# EAGLE design arduino (EAGLE 8.1.1)
AUTHOR: Pat Pannuto; REV: A; TITLE: Seinduino

## Sheet 1 of 2
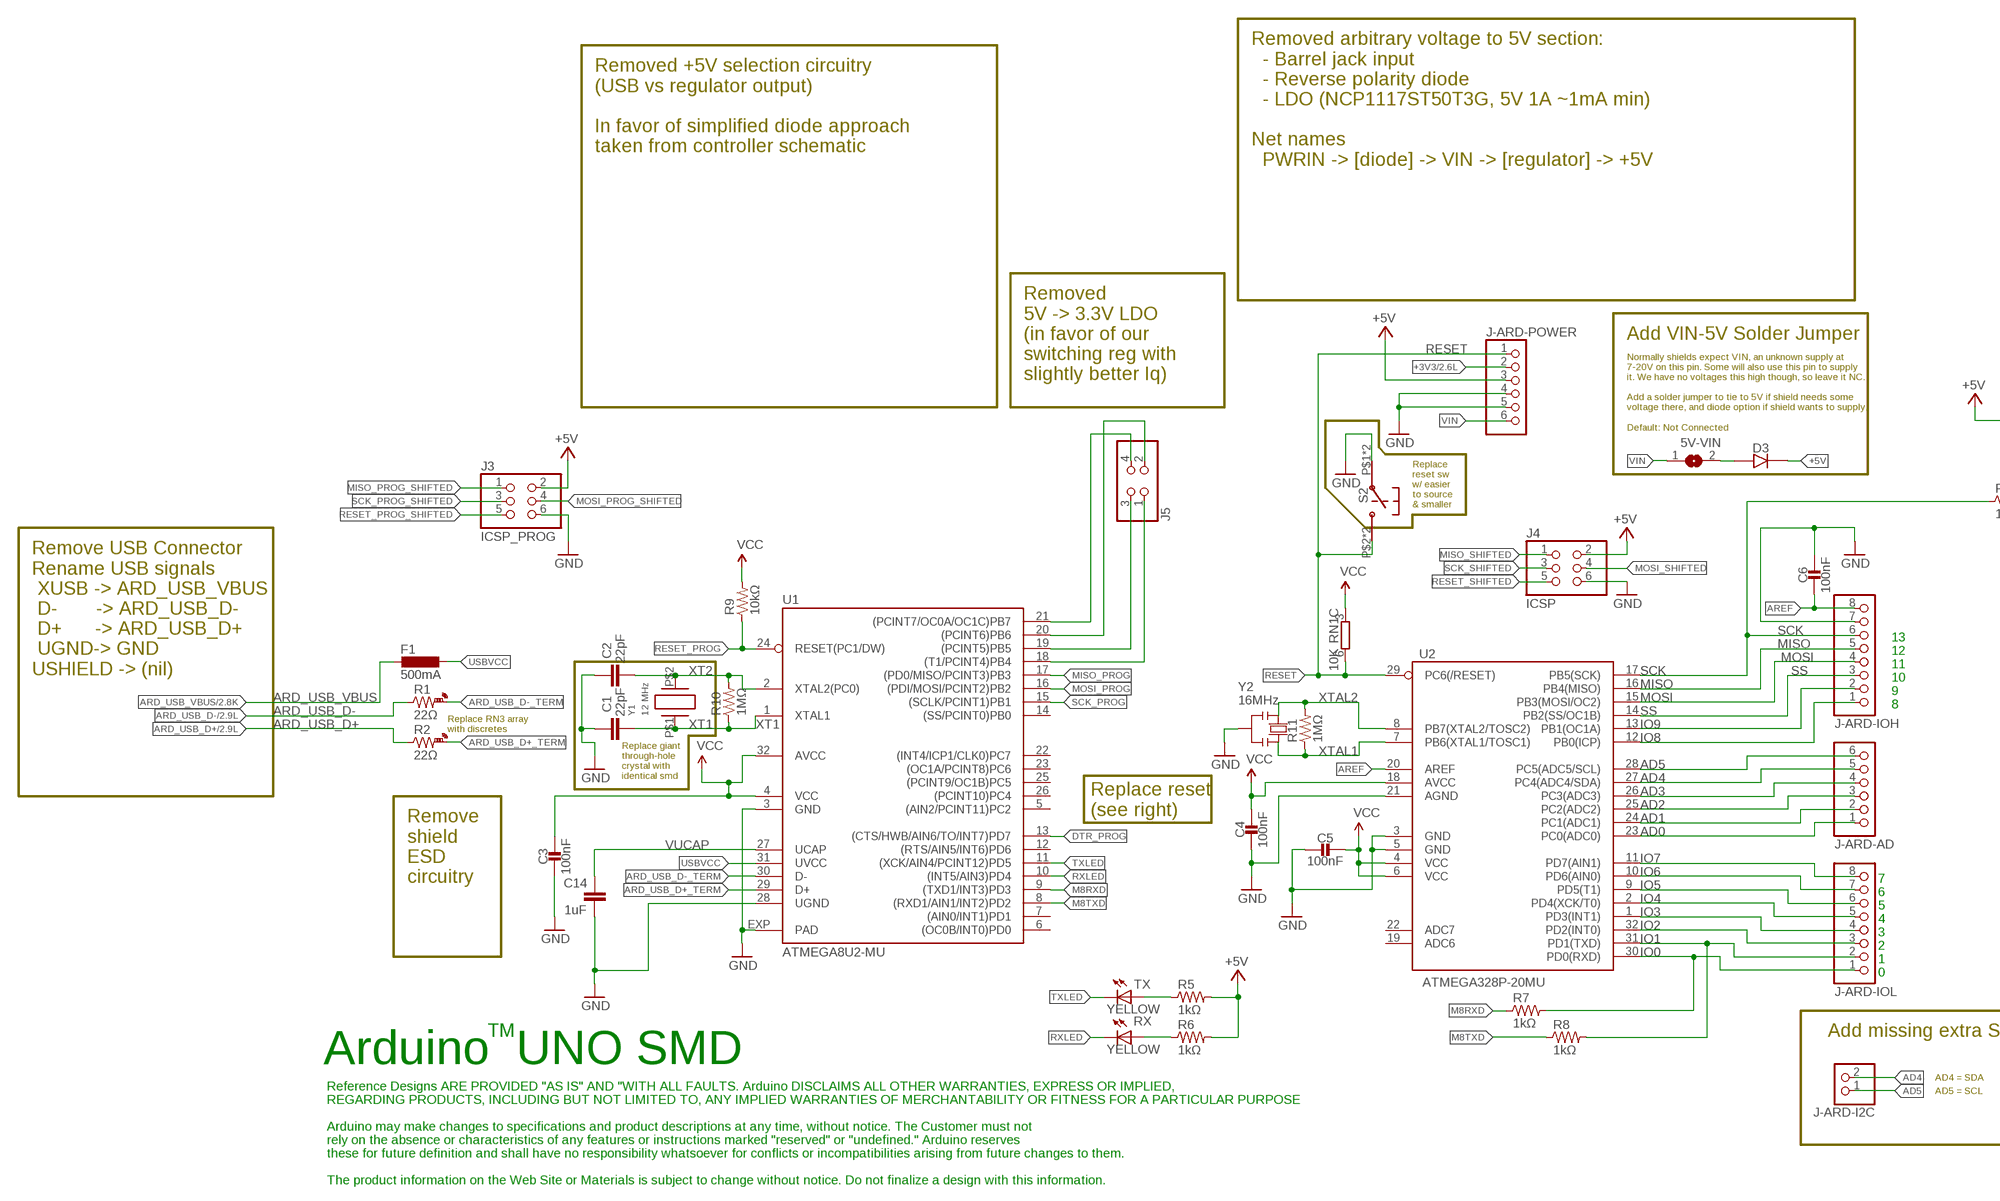
[diagram p0: schematic, sheet 1, part 1 of 2]
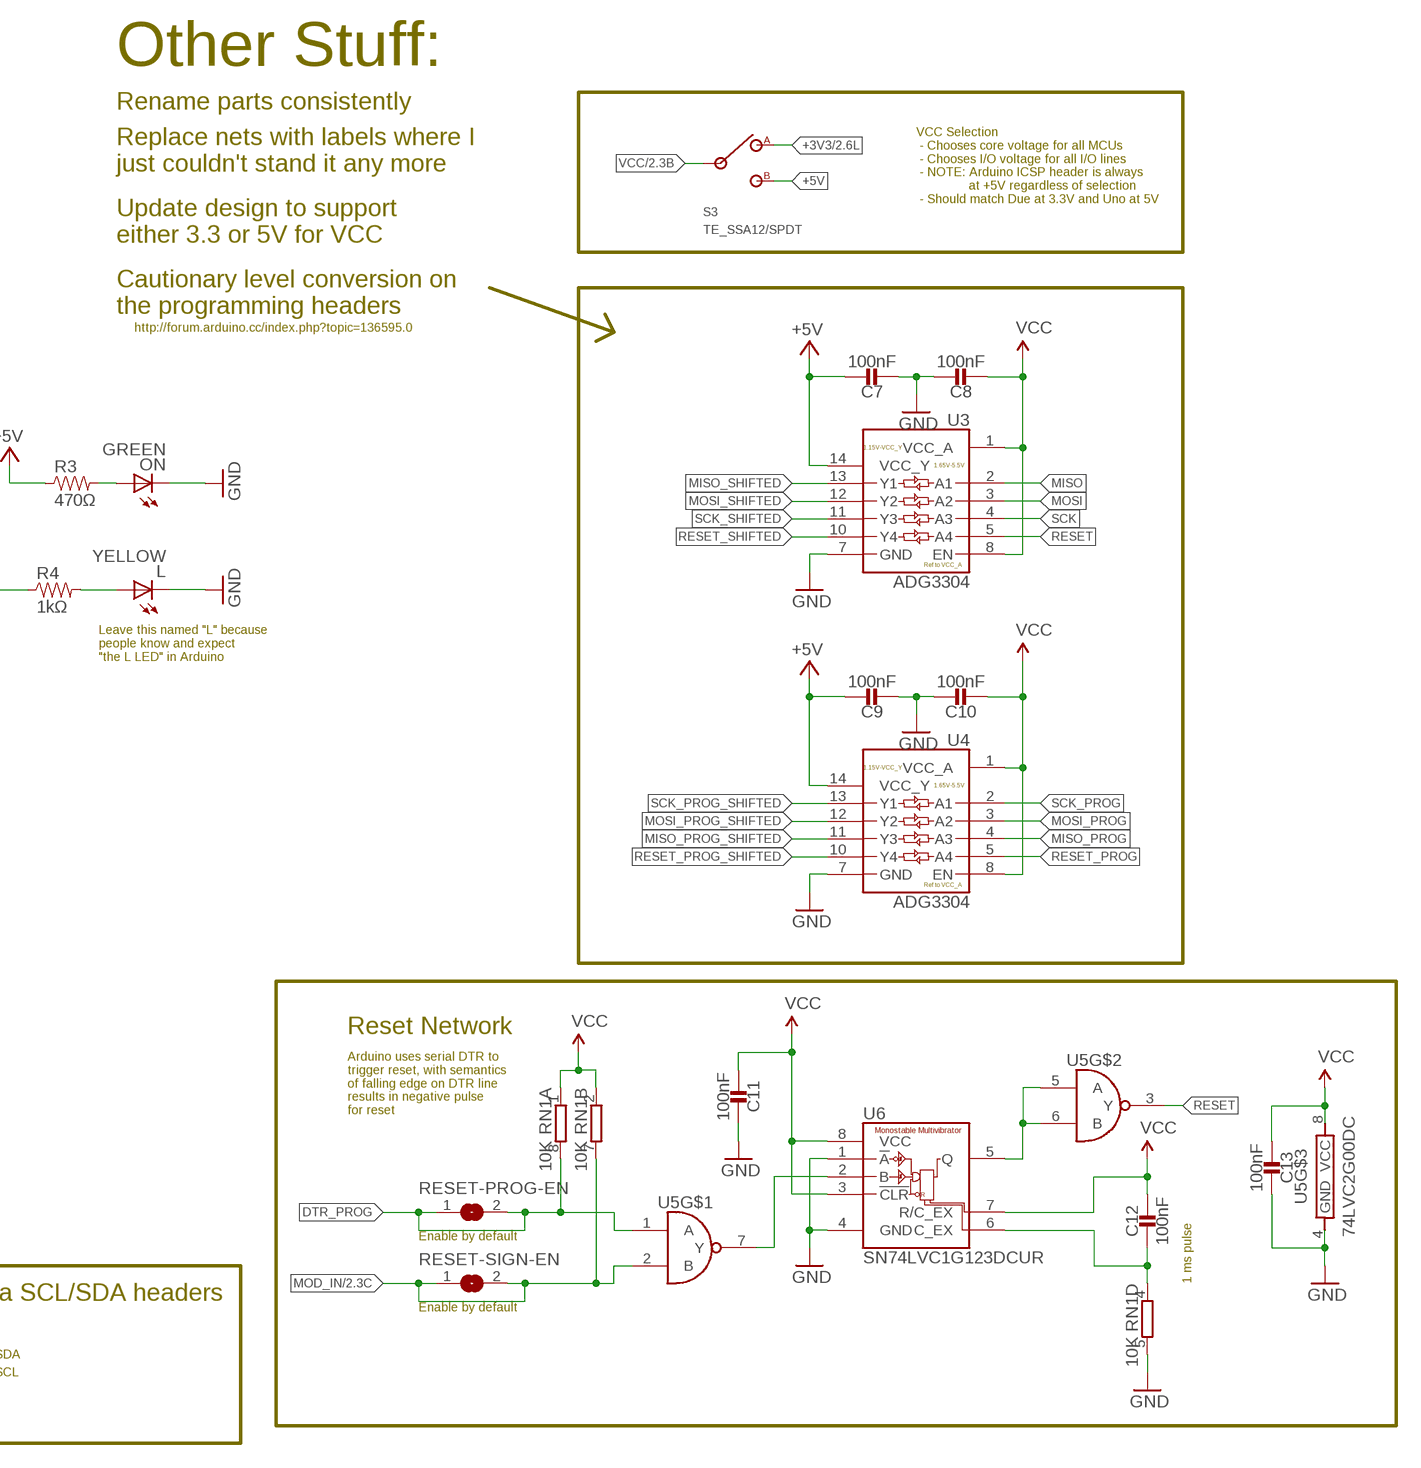
[diagram p1: schematic, sheet 1, part 2 of 2]

### Parts
5V-VIN  SJ  [SJ]
C1  22pF  C-EU0603-RND  [C0603-ROUND]
C2  22pF  C-EU0603-RND  [C0603-ROUND]
C3  100nF  CAPACITOR0603_CAP  [0603_CAP]
C4  100nF  CAPACITOR0603_CAP  [0603_CAP]
C5  100nF  CAPACITOR0603_CAP  [0603_CAP]
C6  100nF  CAPACITOR0603_CAP  [0603_CAP]
C7  100nF  CAPACITOR0603_CAP  [0603_CAP]
C8  100nF  CAPACITOR0603_CAP  [0603_CAP]
C9  100nF  CAPACITOR0603_CAP  [0603_CAP]
C10  100nF  CAPACITOR0603_CAP  [0603_CAP]
C11  100nF  CAPACITOR0603_CAP  [0603_CAP]
C12  100nF  CAPACITOR0603_CAP  [0603_CAP]
C13  100nF  CAPACITOR0603_CAP  [0603_CAP]
C14  1uF  C-EU0603-RND  [C0603-ROUND]
D3  DIODE  [0402_DIODE]
F1  500mA  L-EUL1812  [L1812]
J3  ICSP_PROG  PINHD-2X3  [2X03]
J4  ICSP  PINHD-2X3  [2X03]
J5  PINHD-2X2  [2X02]
J-ARD-AD  PINHD-1X6  [1X06]
J-ARD-I2C  PINHD-1X2  [1X02]
J-ARD-IOH  PINHD-1X8  [1X08]
J-ARD-IOL  PINHD-1X8  [1X08]
J-ARD-POWER  PINHD-1X6  [1X06]
L  YELLOW  LEDCHIP-LED0805  [CHIP-LED0805]
ON  GREEN  LEDCHIP-LED0805  [CHIP-LED0805]
R1  22Ω  RESISTOR-HIGH_SPEED0402  [0402_RES-HIGH_SPEED]
R2  22Ω  RESISTOR-HIGH_SPEED0402  [0402_RES-HIGH_SPEED]
R3  470Ω  RESISTOR0603_RES  [0603-RES]
R4  1kΩ  RESISTOR0603_RES  [0603-RES]
R5  1kΩ  RESISTOR0603_RES  [0603-RES]
R6  1kΩ  RESISTOR0603_RES  [0603-RES]
R7  1kΩ  RESISTOR0603_RES  [0603-RES]
R8  1kΩ  RESISTOR0603_RES  [0603-RES]
R9  10kΩ  RESISTOR0603_RES  [0603-RES]
R10  1MΩ  RESISTOR0603_RES  [0603-RES]
R11  1MΩ  RESISTOR0603_RES  [0603-RES]
RESET-PROG-EN  SJ  [SJ]
RESET-SIGN-EN  SJ  [SJ]
RN1  10K  4R-NCAY16  [CAY16]
RX  YELLOW  LEDCHIP-LED0805  [CHIP-LED0805]
S2  EVQP2  [EVQP2]
S3  TE_SSA12/SPDT  [TE_SSA12/SPDT]
TX  YELLOW  LEDCHIP-LED0805  [CHIP-LED0805]
U1  ATMEGA8U2-MU  [QFN32]
U2  ATMEGA328P-20MU  MEGA8-MI  [MLF32]
U3  ADG3304  [TSSOP-14/5MM]
U4  ADG3304  [TSSOP-14/5MM]
U5  74LVC2G00DC  [VSSOP-8]
U6  SN74LVC1G123DCUR  [VFSOP-8]
Y1  12 MHz  ABM3  [ABM3]
Y2  16MHz  RESONATORMU  [RESONATOR]

### Nets
+3V3: J-ARD-POWER.2 S3.1(A) ; also sheet 2
+5V [usbvcc]: C7.1 C9.1 D3.CATHODE J3.2 J4.2 J-ARD-POWER.3 R3.1 R5.2 R6.2 S3.2(B) U3.14(VCC_Y) U4.14(VCC_Y) ; also sheet 2
AD0: J-ARD-AD.1 U2.23(PC0(ADC0))
AD1: J-ARD-AD.2 U2.24(PC1(ADC1))
AD2: J-ARD-AD.3 U2.25(PC2(ADC2))
AD3: J-ARD-AD.4 U2.26(PC3(ADC3))
AD4: J-ARD-AD.5 J-ARD-I2C.2 U2.27(PC4(ADC4/SDA))
AD5: J-ARD-AD.6 J-ARD-I2C.1 U2.28(PC5(ADC5/SCL))
ARD_USB_D+: R2.2 ; also sheet 2
ARD_USB_D+_TERM: R2.1 U1.29(D+)
ARD_USB_D-: R1.2 ; also sheet 2
ARD_USB_D-_TERM: R1.1 U1.30(D-)
ARD_USB_VBUS [usbvcc]: F1.2 ; also sheet 2
AREF [aref]: C6.2 J-ARD-IOH.8 U2.20(AREF)
DTR_PROG: RESET-PROG-EN.1 RESET-PROG-EN.2 RN1.8 U1.13((CTS/HWB/AIN6/TO/INT7)PD7) U5.1(A)
GND [gnd]: C1.2 C2.2 C3.2 C4.2 C5.2 C6.1 C7.2 C8.1 C9.2 C10.1 C11.1 C13.1 C14.2 J3.6 J4.6 J-ARD-IOH.7 J-ARD-POWER.4 J-ARD-POWER.5 L.C ON.C RN1.5 S2.P$1 S2.P$3 U1.3(GND) U1.28(UGND) U1.EXP(PAD) U2.3(GND) U2.5(GND) U2.21(AGND) U3.7(GND) U4.7(GND) U5.4(GND) U6.1(!A) U6.4(GND) Y2.2 ; also sheet 2
IO0: J-ARD-IOL.1 R7.2 U2.30(PD0(RXD))
IO1: J-ARD-IOL.2 R8.2 U2.31(PD1(TXD))
IO2: J-ARD-IOL.3 U2.32(PD2(INT0))
IO3: J-ARD-IOL.4 U2.1(PD3(INT1))
IO4: J-ARD-IOL.5 U2.2(PD4(XCK/T0))
IO5: J-ARD-IOL.6 U2.9(PD5(T1))
IO6: J-ARD-IOL.7 U2.10(PD6(AIN0))
IO7: J-ARD-IOL.8 U2.11(PD7(AIN1))
IO8: J-ARD-IOH.1 U2.12(PB0(ICP))
IO9: J-ARD-IOH.2 U2.13(PB1(OC1A))
M8RXD: R7.1 U1.9((TXD1/INT3)PD3)
M8TXD: R8.1 U1.8((RXD1/AIN1/INT2)PD2)
MISO: J-ARD-IOH.5 U2.16(PB4(MISO)) U3.2(A1)
MISO_PROG: U1.17((PD0/MISO/PCINT3)PB3) U4.4(A3)
MISO_PROG_SHIFTED: J3.1 U4.11(Y3)
MISO_SHIFTED: J4.1 U3.13(Y1)
MOD_IN: RESET-SIGN-EN.1 RESET-SIGN-EN.2 RN1.7 U5.2(B) ; also sheet 2
MOSI: J-ARD-IOH.4 U2.15(PB3(MOSI/OC2)) U3.3(A2)
MOSI_PROG: U1.16((PDI/MOSI/PCINT2)PB2) U4.3(A2)
MOSI_PROG_SHIFTED: J3.4 U4.12(Y2)
MOSI_SHIFTED: J4.4 U3.12(Y2)
N$1: L.A R4.2
N$2: J5.1 U1.18((T1/PCINT4)PB4)
N$3: ON.A R3.2
N$4: J5.3 U1.19((PCINT5)PB5)
N$5: J5.2 U1.20((PCINT6)PB6)
N$6: J5.4 U1.21((PCINT7/OC0A/OC1C)PB7)
N$7: C12.2 RN1.4 U6.6(C_EX)
N$9: 5V-VIN.2 D3.ANODE
N$10: U5.7(Y) U6.2(B)
N$13: U5.5(A) U5.6(B) U6.5(Q)
N$35: R6.1 RX.A
N$36: R5.1 TX.A
RESET: J-ARD-POWER.1 RN1.6 S2.P$2 S2.P$4 U2.29(PC6(/RESET)) U3.5(A4) U5.3(Y)
RESET_PROG: R9.1 U1.24(RESET(PC1/DW)) U4.5(A4)
RESET_PROG_SHIFTED: J3.5 U4.10(Y4)
RESET_SHIFTED: J4.5 U3.10(Y4)
RXLED: RX.C U1.10((INT5/AIN3)PD4)
SCK: J-ARD-IOH.6 R4.1 U2.17(PB5(SCK)) U3.4(A3)
SCK_PROG: U1.15((SCLK/PCINT1)PB1) U4.2(A1)
SCK_PROG_SHIFTED: J3.3 U4.13(Y1)
SCK_SHIFTED: J4.3 U3.11(Y3)
SS: J-ARD-IOH.3 U2.14(PB2(SS/OC1B))
TXLED: TX.C U1.11((XCK/AIN4/PCINT12)PD5)
USBVCC [usbvcc]: F1.1 U1.31(UVCC)
VCC: C3.1 C4.1 C5.1 C8.2 C10.2 C11.2 C12.1 C13.2 R9.2 RN1.1 RN1.2 RN1.3 S3.IN U1.4(VCC) U1.32(AVCC) U2.4(VCC) U2.6(VCC) U2.18(AVCC) U3.1(VCC_A) U3.8(EN) U4.1(VCC_A) U4.8(EN) U5.8(VCC) U6.3(!CLR) U6.7(R/C_EX) U6.8(VCC) ; also sheet 2
VIN [power]: 5V-VIN.1 J-ARD-POWER.6
VUCAP: C14.1 U1.27(UCAP)
XT1: C1.1 R10.1 U1.1(XTAL1) Y1.P$1
XT2: C2.1 R10.2 U1.2(XTAL2(PC0)) Y1.P$2
XTAL1: R11.1 U2.7(PB6(XTAL1/TOSC1)) Y2.3
XTAL2: R11.2 U2.8(PB7(XTAL2/TOSC2)) Y2.1
Unconnected: U1.5((AIN2/PCINT11)PC2) U1.6((OC0B/INT0)PD0) U1.7((AIN0/INT1)PD1) U1.12((RTS/AIN5/INT6)PD6) U1.14((SS/PCINT0)PB0) U1.22((INT4/ICP1/CLK0)PC7) U1.23((OC1A/PCINT8)PC6) U1.25((PCINT9/OC1B)PC5) U1.26((PCINT10)PC4) U2.19(ADC6) U2.22(ADC7)

### Notes on the sheet
- This board starts from the official Arduino UNO SMD (aka UNO RevG-MU), available here:
  https://www.arduino.cc/en/uploads/Main/arduino-uno-smd-reference-design.zip
  
  Modifications to the Ardunio layout are noted on the guide layer of this sheet
- Removed arbitrary voltage to 5V section:
    - Barrel jack input
    - Reverse polarity diode
    - LDO (NCP1117ST50T3G, 5V 1A ~1mA min)
  
  Net names
    PWRIN -> [diode] -> VIN -> [regulator] -> +5V
- Removed +5V selection circuitry
  (USB vs regulator output)
  
  In favor of simplified diode approach
  taken from controller schematic
- Other Stuff:
- Rename parts consistently
- Replace nets with labels where I
  just couldn't stand it any more
- VCC Selection
   - Chooses core voltage for all MCUs
   - Chooses I/O voltage for all I/O lines
   - NOTE: Arduino ICSP header is always
                 at +5V regardless of selection
   - Should match Due at 3.3V and Uno at 5V
- Update design to support
  either 3.3 or 5V for VCC
- Cautionary level conversion on
  the programming headers
- Removed
  5V -> 3.3V LDO
  (in favor of our
  switching reg with
  slightly better Iq)
- http://forum.arduino.cc/index.php?topic=136595.0
- Add VIN-5V Solder Jumper
- Normally shields expect VIN, an unknown supply at
  7-20V on this pin. Some will also use this pin to supply
  it. We have no voltages this high though, so leave it NC.
  
  Add a solder jumper to tie to 5V if shield needs some
  voltage there, and diode option if shield wants to supply.
  
  Default: Not Connected
- Replace
  reset sw
  w/ easier
  to source
  & smaller
- Leave this named "L" because
  people know and expect
  "the L LED" in Arduino
- Remove USB Connector
  Rename USB signals
   XUSB -> ARD_USB_VBUS
   D-       -> ARD_USB_D-
   D+      -> ARD_USB_D+
   UGND-> GND
  USHIELD -> (nil)
- 13
- 12
- 11
- 10
- 9
- 8
- Replace RN3 array
  with discretes
- Replace giant
  through-hole
  crystal with
  identical smd
- Replace reset
  (see right)
- Remove
  shield
  ESD
  circuitry
- Reset Network
- Arduino uses serial DTR to
  trigger reset, with semantics
  of falling edge on DTR line
  results in negative pulse
  for reset
- 7
- 6
- 5
- 4
- 3
- 2
- 1
- 0
- Enable by default
- 1 ms pulse
- TM | Add missing extra SCL/SDA headers | Enable by default
- Arduino  UNO SMD
- AD4 = SDA
- Reference Designs ARE PROVIDED "AS IS" AND "WITH ALL FAULTS. Arduino DISCLAIMS ALL OTHER WARRANTIES, EXPRESS OR IMPLIED, | AD5 = SCL
- REGARDING PRODUCTS, INCLUDING BUT NOT LIMITED TO, ANY IMPLIED WARRANTIES OF MERCHANTABILITY OR FITNESS FOR A PARTICULAR PURPOSE
- Arduino may make changes to specifications and product descriptions at any time, without notice. The Customer must not
- rely on the absence or characteristics of any features or instructions marked "reserved" or "undefined." Arduino reserves
- these for future definition and shall have no responsibility whatsoever for conflicts or incompatibilities arising from future changes to them.
- The product information on the Web Site or Materials is subject to change without notice. Do not finalize a design with this information.

## Sheet 2 of 2
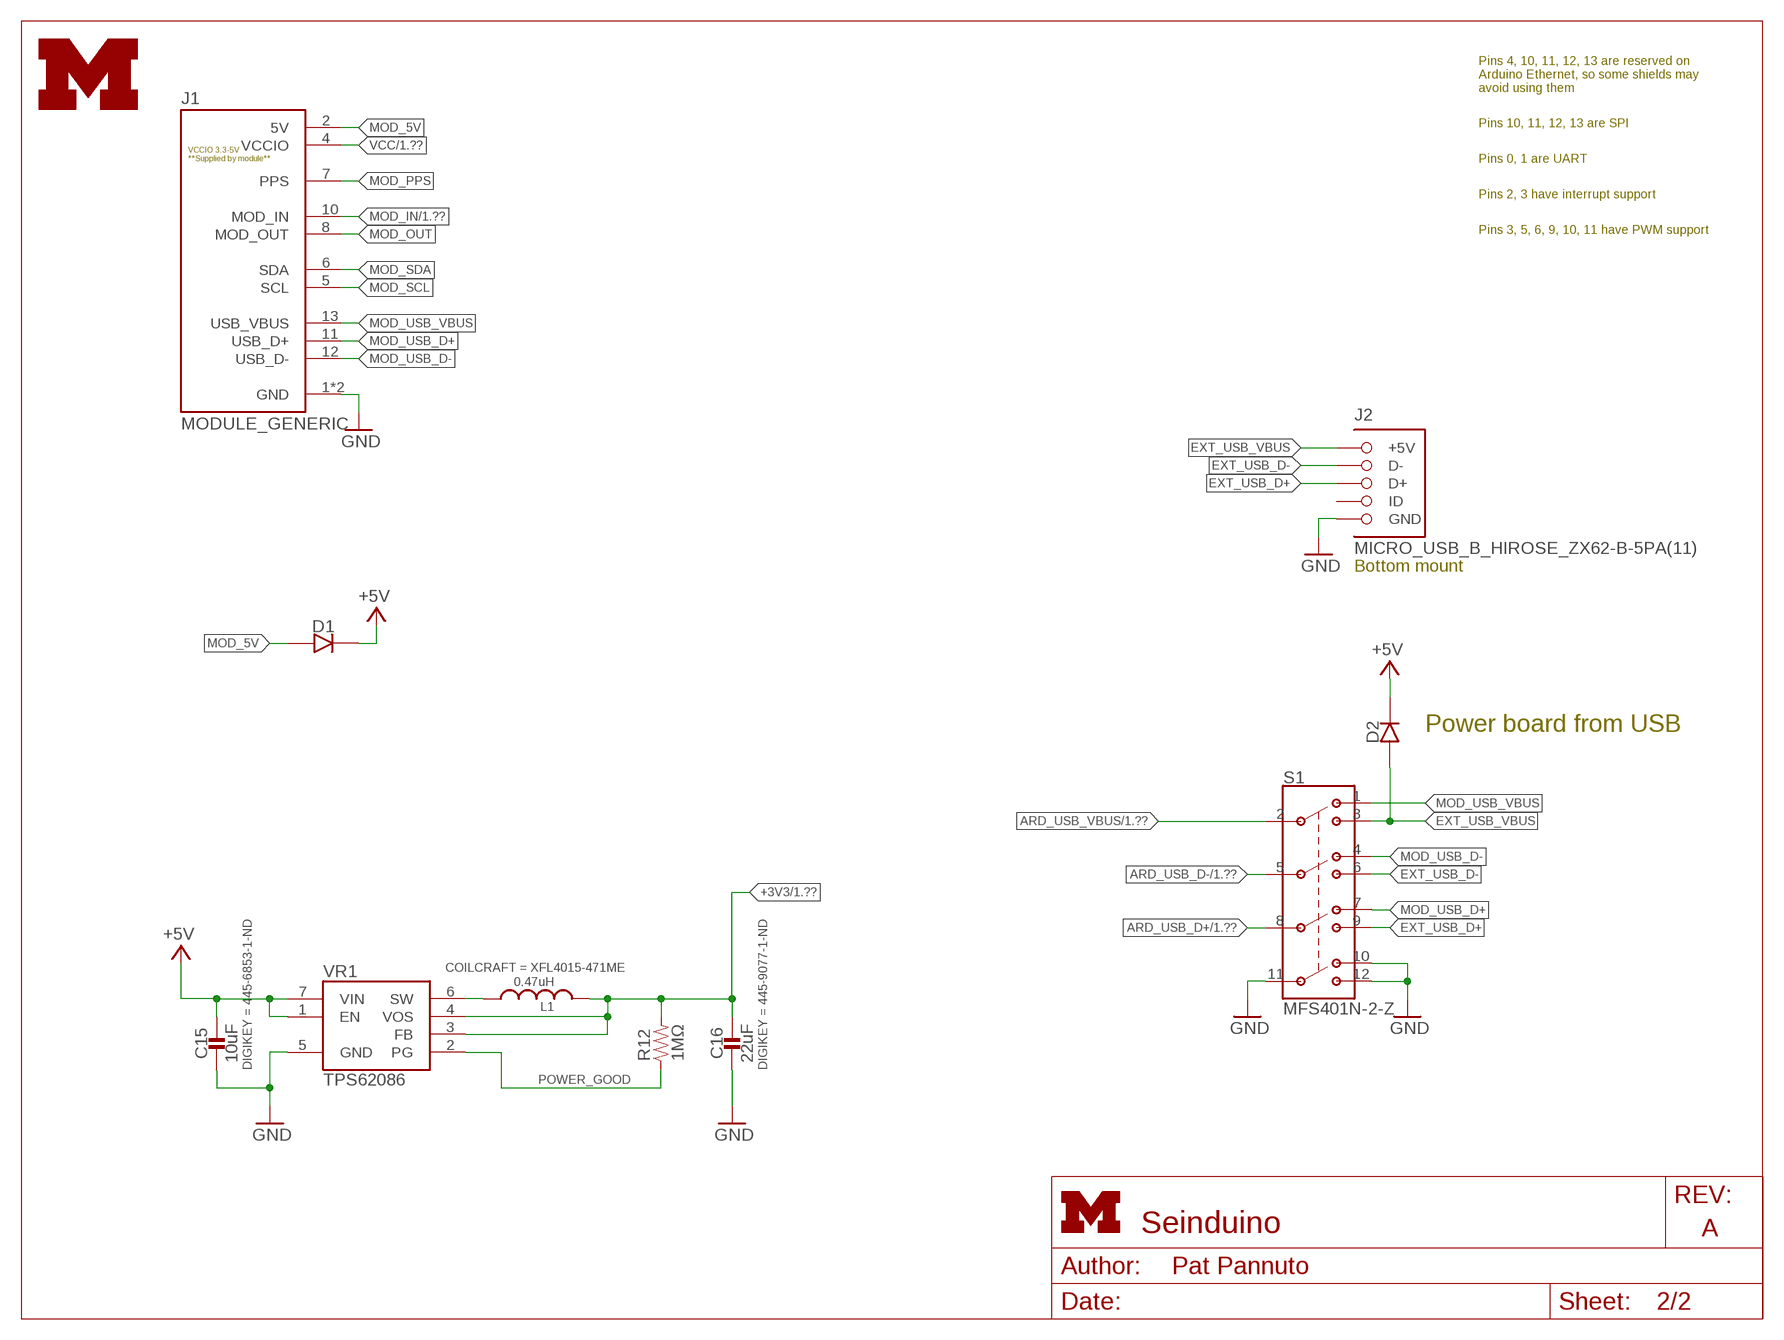
[diagram p2: schematic, sheet 2]
FRAME1 (LETTER_L_UMICH): HEIGHT: 8.5in; WIDTH: 11in

### Parts
C15  10uF  CAPACITOR0603_CAP  [0603_CAP]
C16  22uF  CAPACITOR0603_CAP  [0603_CAP]
D1  DIODE  [0402_DIODE]
D2  DIODE  [0402_DIODE]
J1  MODULE_GENERIC  [MODULE_GENERIC]
J2  MICRO_USB_B_HIROSE_ZX62-B-5PA(11)  [USB_MICRO_B-HIROSE-ZX62-B-5PA(11)]
L1  0.47uH  INDUCTORXFL4015  [XFL4015]
LOGO1  UMICH_SOLID_MEDIUM  [UMICH_SOLID_200MIL]
R12  1MΩ  RESISTOR0603_RES  [0603-RES]
S1  MFS401N-2-Z  [MFS401N-2-Z]
VR1  TPS62086  [RLT0007A]

### Nets
+3V3: C16.1 L1.2 R12.2 VR1.3(FB) VR1.4(VOS) ; also sheet 1
+5V [usbvcc]: C15.1 D1.CATHODE D2.CATHODE VR1.1(EN) VR1.7(VIN) ; also sheet 1
ARD_USB_D+: S1.8(3P) ; also sheet 1
ARD_USB_D-: S1.5(2P) ; also sheet 1
ARD_USB_VBUS [usbvcc]: S1.2(1P) ; also sheet 1
EXT_USB_D+: J2.3(D+) S1.9(3TB)
EXT_USB_D-: J2.2(D-) S1.6(2TB)
EXT_USB_VBUS: D2.ANODE J2.1(+5V) S1.3(1TB)
GND [gnd]: C15.2 C16.2 J1.1(GND) J1.14(GND) J2.5(GND) S1.10(4TA) S1.11(4P) S1.12(4TB) VR1.5(GND) ; also sheet 1
MOD_5V: D1.ANODE J1.2(5V)
MOD_IN: J1.10(MOD_IN) ; also sheet 1
MOD_OUT: J1.8(MOD_OUT)
MOD_PPS: J1.7(PPS)
MOD_SCL: J1.5(SCL)
MOD_SDA: J1.6(SDA)
MOD_USB_D+: J1.11(USB_D+) S1.7(3TA)
MOD_USB_D-: J1.12(USB_D-) S1.4(2TA)
MOD_USB_VBUS: J1.13(USB_VBUS) S1.1(1TA)
POWER_GOOD: R12.1 VR1.2(PG)
VCC: J1.4(VCCIO) ; also sheet 1
VR_IND_SW: L1.1 VR1.6(SW)
Unconnected: J2.4(ID)

### Notes on the sheet
- Pins 4, 10, 11, 12, 13 are reserved on
  Arduino Ethernet, so some shields may
  avoid using them
- Pins 10, 11, 12, 13 are SPI
- Pins 0, 1 are UART
- Pins 2, 3 have interrupt support
- Pins 3, 5, 6, 9, 10, 11 have PWM support
- Bottom mount
- Power board from USB

## Library data of the parts
5V-VIN RESET-PROG-EN RESET-SIGN-EN = jumper:SJ: SMD solder JUMPER
C1 C2 C14 = SmartPrj:C-EU: CAPACITOR, European symbol
C3-C13 = passives:CAPACITOR: 0402 Capacitor
C15 = passives:CAPACITOR: 0402 Capacitor; DIGIKEY: 445-6853-1-ND
C16 = passives:CAPACITOR: 0402 Capacitor; DIGIKEY: 445-9077-1-ND
D1-D3 = passives:DIODE; DIGIKEY: P18981CT-ND
F1 = rcl:L-EU: INDUCTOR, European symbol; DIGIKEY: MF-MSMF050-2CT-ND
J1 = signpost:MODULE_GENERIC: Module header and PCB guildes for signposts; DIGIKEY: S9170-ND
J2 = connector:MICRO_USB_B_HIROSE_ZX62-B-5PA(11): Connector Receptacle USB - micro B 2.0 5 Position Surface Mount, Right Angle, Horizontal Bottom Mount; DIGIKEY: H11634CT-ND; MOUSER: 798-ZX62-B-5PA11; NEWARK: 86P8793
J3 J4 = pinhead:PINHD-2X3: PIN HEADER
J5 = pinhead:PINHD-2X2: PIN HEADER
J-ARD-AD J-ARD-POWER = pinhead:PINHD-1X6: PIN HEADER
J-ARD-I2C = pinhead:PINHD-1X2: PIN HEADER
J-ARD-IOH J-ARD-IOL = pinhead:PINHD-1X8: PIN HEADER
L ON RX TX = led:LED: LED OSRAM: - CHIPLED LG R971, LG N971, LY N971, LG Q971, LY Q971, LO R971, LY R971 LH N974, LH R974 LS Q976, LO Q976, LY Q976 LO Q996 - Hyper CHIPLED LW Q18S LB Q993, LB Q99A, LB R99A - SideLED LS A670, LO A670, LY A670, LG A670, LP A670 LB A673, LV A673, LT A673, LW A673 LH A674 LY A675 LS A676, LA A676, LO A676, LY A676, LW A676 LS A679, LY A679, LG A679 - Hyper Micro SIDELED® LS Y876, LA Y876, LO Y876, LY Y876 LT Y87S - SmartLED LW L88C, LW L88S LB L89C, LB L89S, LG L890 LS L89K, LO L89K, LY L89K LS L896, LA L896, LO L896, LY L896 - TOPLED LS T670, LO T670, LY T670, LG T670, LP T670 LSG T670, LSP T670, LSY T670, LOP T670, LYG T670 LG T671, LOG T671, LSG T671 LB T673, LV T673, LT T673, LW T673 LH T674 LS T676, LA T676, LO T676, LY T676, LB T676, LH T676, LSB T676, LW T676 LB T67C, LV T67C, LT T67C, LS T67K, LO T67K, LY T67K, LW E67C LS E67B, LA E67B, LO E67B, LY E67B, LB E67C, LV E67C, LT E67C LW T67C LS T679, LY T679, LG T679 LS T770, LO T770, LY T770, LG T770, LP T770 LB T773, LV T773, LT T773, LW T773 LH T774 LS E675, LA E675, LY E675, LS T675 LS T776, LA T776, LO T776, LY T776, LB T776 LHGB T686 LT T68C, LB T68C - Hyper Mini TOPLED® LB M676 - Mini TOPLED Santana® LG M470 LS M47K, LO M47K, LY M47K Source: http://www.osram.convergy.de LUXEON: - LUMILED® LXK2-PW12-R00, LXK2-PW12-S00, LXK2-PW14-U00, LXK2-PW14-V00 LXK2-PM12-R00, LXK2-PM12-S00, LXK2-PM14-U00 LXK2-PE12-Q00, LXK2-PE12-R00, LXK2-PE12-S00, LXK2-PE14-T00, LXK2-PE14-U00 LXK2-PB12-K00, LXK2-PB12-L00, LXK2-PB12-M00, LXK2-PB14-N00, LXK2-PB14-P00, LXK2-PB14-Q00 LXK2-PR12-L00, LXK2-PR12-M00, LXK2-PR14-Q00, LXK2-PR14-R00 LXK2-PD12-Q00, LXK2-PD12-R00, LXK2-PD12-S00 LXK2-PH12-R00, LXK2-PH12-S00 LXK2-PL12-P00, LXK2-PL12-Q00, LXK2-PL12-R00 Source: www.luxeon.com KINGBRIGHT: KA-3528ASYC Source: www.kingbright.com
L1 = passives:INDUCTOR: A very specific inductor; COILCRAFT: XFL4015-471ME
LOGO1 = logos:UMICH_SOLID
R1 R2 = passives:RESISTOR-HIGH_SPEED: Resistor with keepout, for inline on high-speed traces (e.g. USB)
R3-R12 = passives:RESISTOR: Resistor Basic schematic elements and footprints for 0603, 1206, and PTH resistors.
RN1 = resistor-dil:4R-N: Array Chip Resistor Source: RS Component / Phycomp; DIGIKEY: CAY16-103J4GLFCT-ND
S1 = switches:MFS401N-2-Z: 4PDT Switch; DIGIKEY: 563-1568-ND
S2 = switches:EVQP2: SWITCH TACTILE SPST-NO 0.02A 15V; DIGIKEY: P11084SCT-ND
S3 = switches:TE_SSA12/SPDT: SWITCH SLIDE SPDT 2POS SSA SER; DIGIKEY: 450-1602-ND
U1 = atmel:ATMEGA8U2-MU; DIGIKEY: ATMEGA8U2-MURCT-ND
U2 = idii:MEGA8: MICROCONTROLLER 8 Kbytes FLASH 1 kbytes SRAM 512 bytes EEPROM USART 6-channel 10 bit ADC 2-channel 8 bit ADC Source: avr.lbr; DIGIKEY: ATMEGA328P-MU-ND
U3 U4 = chips:ADG3304: Bidirectional level translation; 1.15 V to 5.5 V; Low quiescent current <5 uA; No direction pin; DIGIKEY: ADG3304BRUZ-ND
U5 = chips:74LVC2G00DC: NAND, 2-Array; DIGIKEY: 568-7671-1-ND
U6 = chips:SN74LVC1G123DCUR: Monostable Multivibrator; DIGIKEY: 296-18578-1-ND
VR1 = regulators:TPS62086: Buck Switching Regulator IC Positive Fixed 3.3V 1 Output 3A 7-VFDFN; DIGIKEY: 296-40831-1-ND
Y1 = crystals:ABM3; DIGIKEY: 535-9103-1-ND
Y2 = SmartPrj:RESONATOR; DIGIKEY: 490-1198-1-ND

## Net classes
0 default: width 0.152 mm, drill 0.61 mm, clearance 0.152 mm
1 power: width 0.406 mm, drill 0.61 mm, clearance 0.152 mm
2 gnd: width 0.203 mm, drill 0.61 mm, clearance 0.152 mm
3 usbvcc: width 0.203 mm, drill 0.61 mm, clearance 0.152 mm
4 aref: width 0.203 mm, drill 0.61 mm, clearance 0.152 mm

## Board
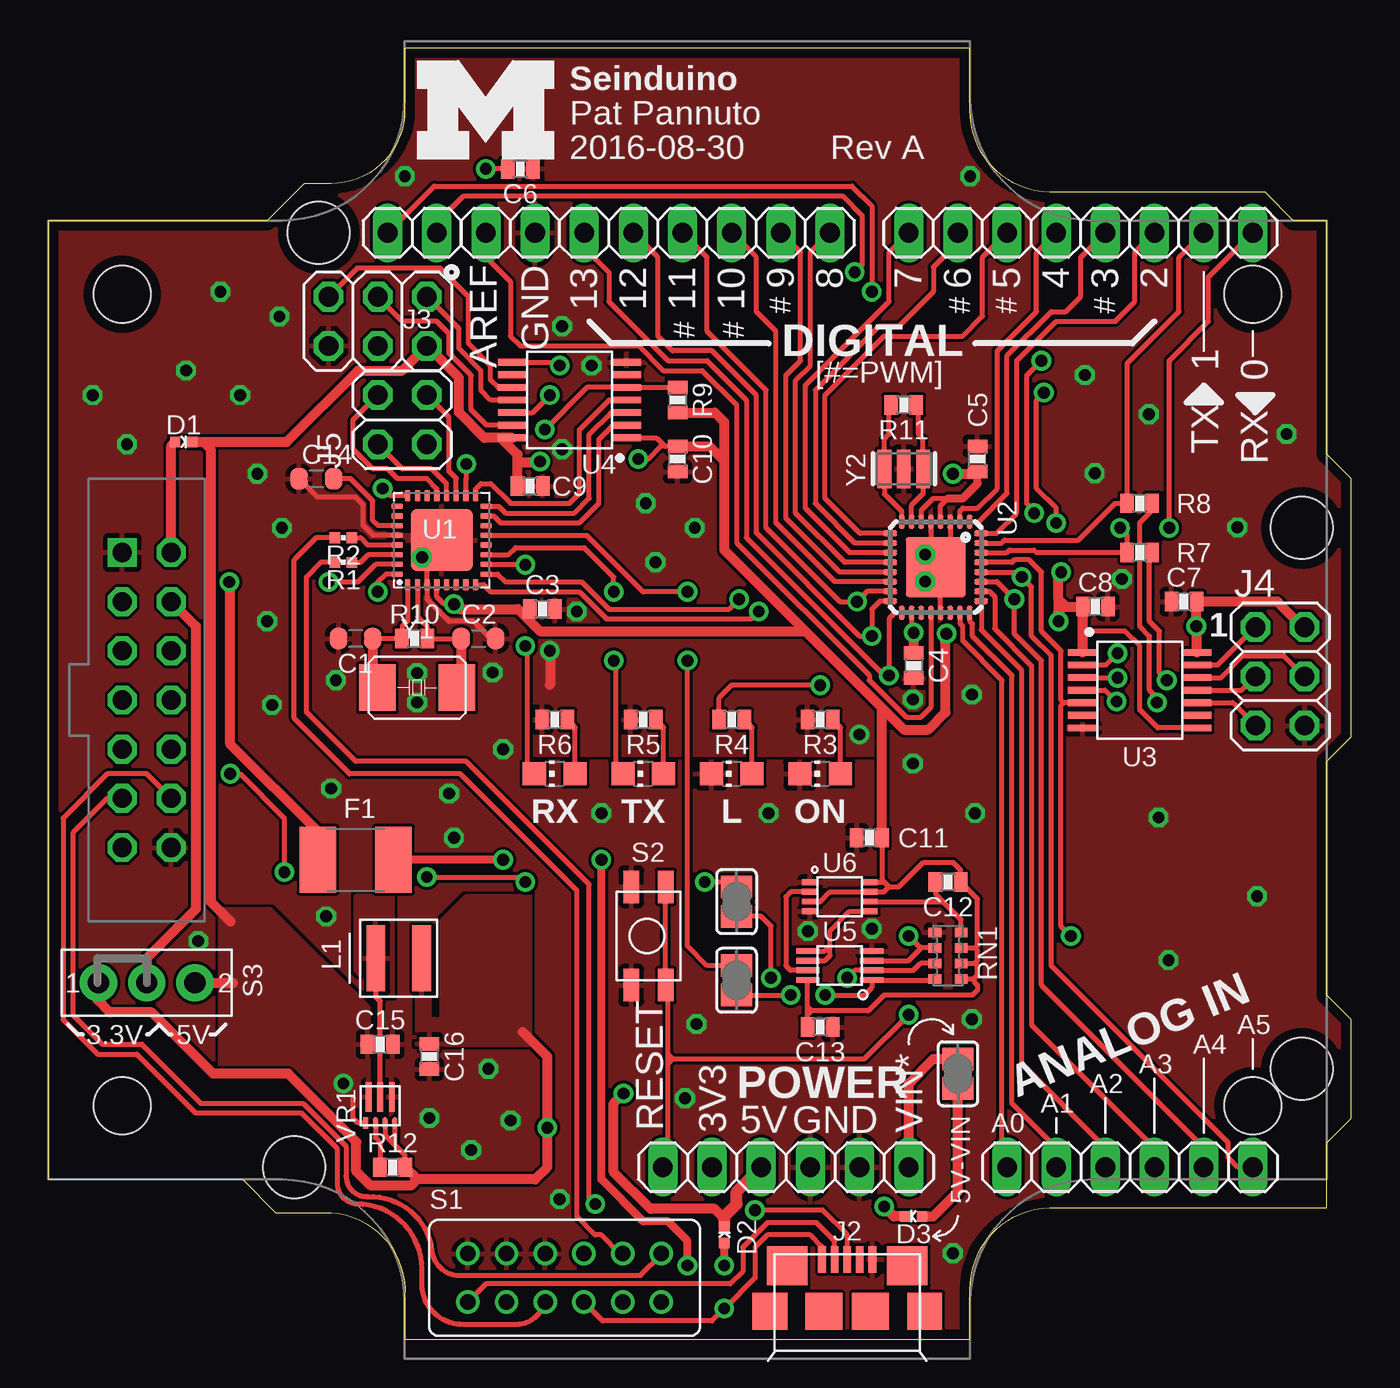
[diagram p3: board, top side]
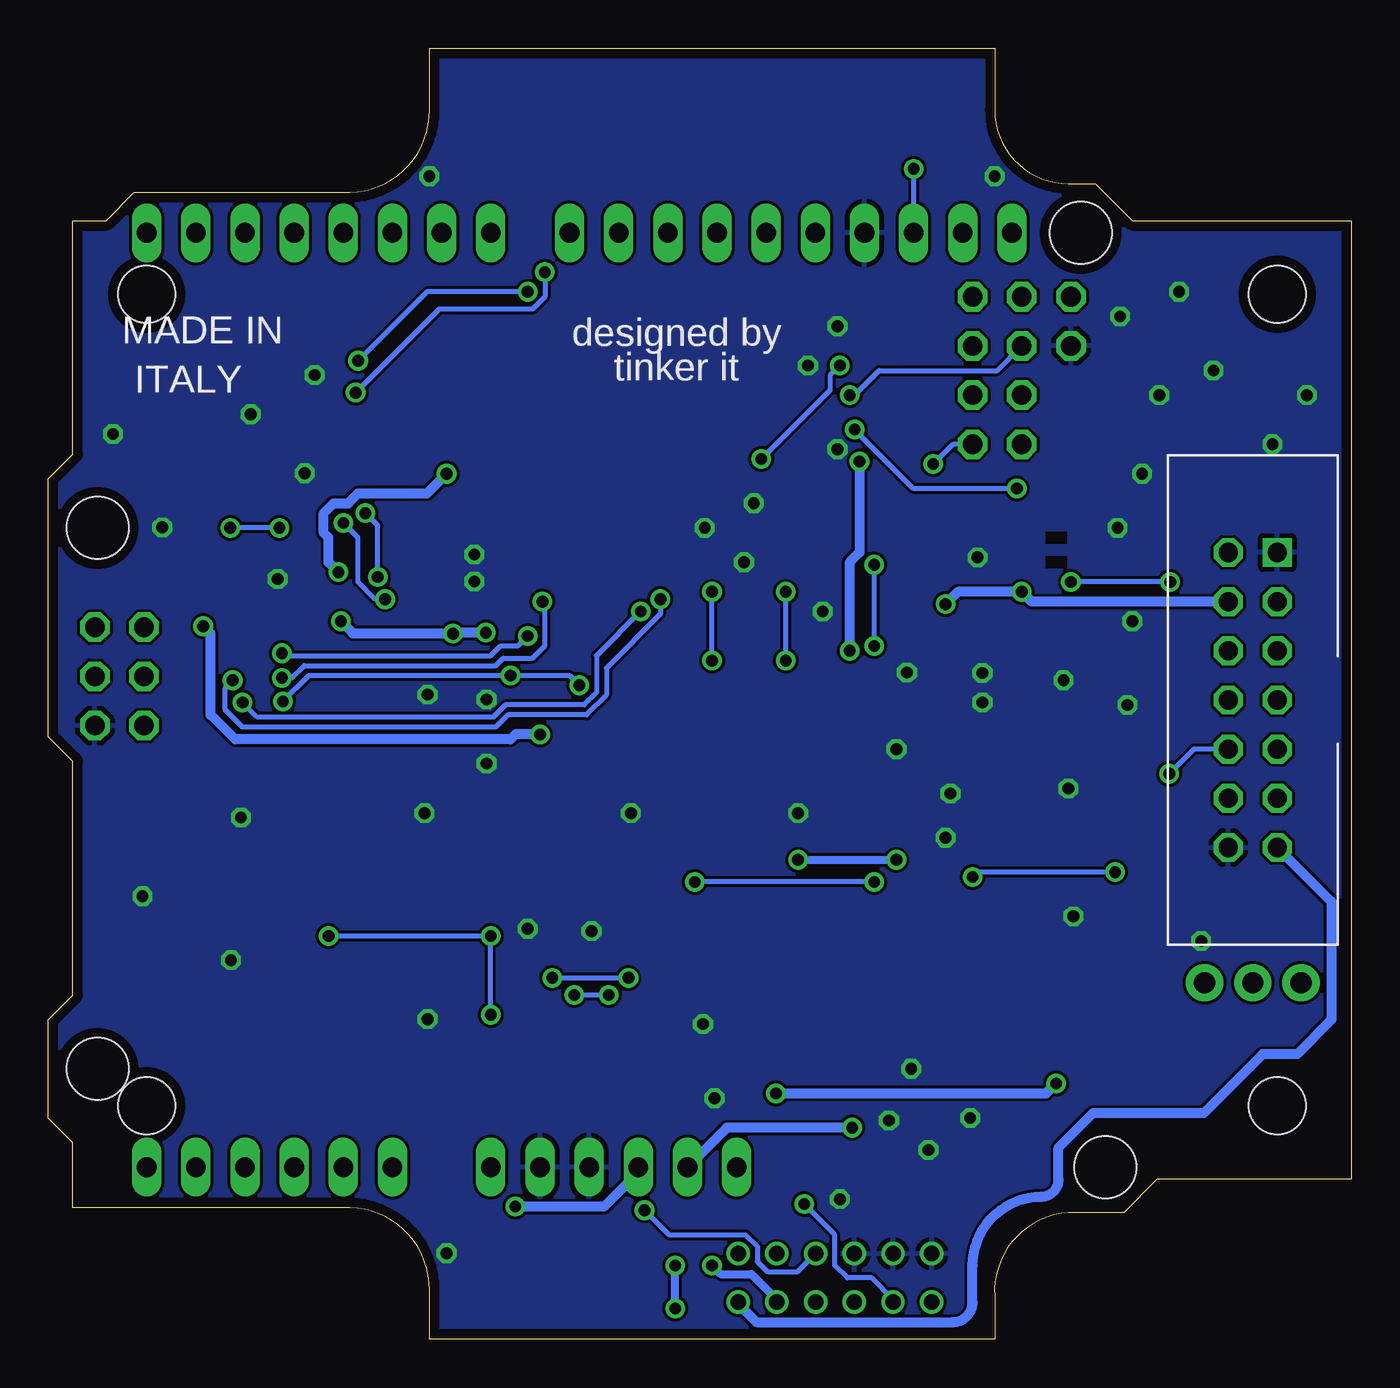
[diagram p4: board, bottom side, seen from below]

Size 67.31 x 66.67 mm. Coordinates in mm from the lower left corner, seen from the top.
Outline: 0,8.25 10.03,8.25 11.75,6.54 14.61,6.54 arc-90 18.41,2.22 18.41,0 47.62,0 47.62,2.54 arc-90 51.75,6.79 66.04,6.79 66.04,10.16 67.31,11.43 67.31,16.51 66.04,17.78 66.04,29.84 67.31,31.12 67.31,44.45 66.04,45.72 66.04,57.79 64.33,57.79 62.87,59.25 51.75,59.25 arc-90 47.62,63.5 47.62,66.67 18.41,66.67 18.41,63.5 arc-90 14.61,59.69 13.21,59.69 11.3,57.79 0,57.79 0,8.25
Copper layers (1*16): Top 0.0178mm / dielectric 59mil / Bottom 0.0178mm
Design rules "sunstone-2lyr_v1.0.0.3": minimum track width 6mil, minimum drill 14mil, track to track 6mil, track to pad 6mil, pad to pad 6mil, via to via 6mil, smd to smd 6mil, copper to edge 20mil, drill to drill 16mil, minimum pad ring 8mil, minimum via ring 8mil, stop-mask expansion 3mil, vias tented up to drill 50mil, thermal gap 10mil
Holes 3.2 mm at 64.77,41.91 64.77,13.97 13.97,57.15 12.7,8.89
Holes 2.95 mm at 3.81,12.06 3.81,53.98 62.23,53.98 62.23,12.06
vRestrict: area 21.6,51.2 to 23.4,56.3; area 24.1,51.8 to 25.8,55.5; area 27.2,51.7 to 28.3,55.1; area 29.7,51.7 to 30.9,55.1; area 32.3,51.7 to 33.4,55.1; area 34.8,51.7 to 35.9,55.1; area 37.5,53.6 to 38.6,55.1; area 39,51.4 to 46.4,53.2; area 43.6,53.8 to 44.8,55.2; area 46.4,53.7 to 47.5,55.2; area 48.9,53.7 to 50,55.2; area 51.6,53.7 to 52.7,55.2; 5 more areas

### Footprints (pad centres in the part's own frame; a part is rotated, then mirrored left to right if it is on the bottom)
SJ = smd 1.168 x 1.6: 1 -0.762,0; 2 0.762,0
C0603-ROUND = smd 0.898 x 1.1: 1 -0.889,0; 2 0.889,0
0603_CAP = smd 0.7 x 1: 1 -0.65,0; 2 0.65,0
0402_DIODE = smd 0.536 x 0.546: ANODE -0.433,0; CATHODE 0.433,0
L1812 = smd 1.9 x 3.4: 1 -1.95,0; 2 1.95,0
MODULE_GENERIC = drill 0.991 square: 1 7.62,29.21 | drill 0.991 octagon: 2 7.62,26.67; 3 5.08,29.21; 4 5.08,26.67; 5 2.54,29.21; 6 2.54,26.67; 7 0,29.21; 8 0,26.67; 9 -2.54,29.21; 10 -2.54,26.67; 11 -5.08,29.21; 12 -5.08,26.67; 13 -7.62,29.21; 14 -7.62,26.67
USB_MICRO_B-HIROSE-ZX62-B-5PA(11) = smd 0.4 x 1.35: 1 -1.3,4.125; 2 -0.65,4.125; 3 0,4.125; 4 0.65,4.125; 5 1.3,4.125 | smd 2.1 x 2: P$1 3.1,3.8; P$2 -3.1,3.8 | smd 1.8 x 1.9: P$3 -4,1.45; P$6 4,1.45 | smd 1.9 x 1.9: P$4 -1.2,1.45; P$5 1.2,1.45
2X03 = drill 1.016 octagon: 1 -2.54,-1.27; 2 -2.54,1.27; 3 0,-1.27; 4 0,1.27; 5 2.54,-1.27; 6 2.54,1.27
2X02 = drill 1.016 octagon: 1 -1.27,-1.27; 2 -1.27,1.27; 3 1.27,-1.27; 4 1.27,1.27
1X06 = drill 1.016 long: 1 -6.35,0; 2 -3.81,0; 3 -1.27,0; 4 1.27,0; 5 3.81,0; 6 6.35,0
1X02 = drill 1.016 long: 1 -1.27,0; 2 1.27,0
1X08 = drill 1.016 long: 1 -8.89,0; 2 -6.35,0; 3 -3.81,0; 4 -1.27,0; 5 1.27,0; 6 3.81,0; 7 6.35,0; 8 8.89,0
CHIP-LED0805 = smd 1.2 x 1.2: A 0,-1.05; C 0,1.05
XFL4015 = smd 0.965 x 3.404: 1 -1.181,0; 2 1.181,0
0402_RES-HIGH_SPEED = smd 0.536 x 0.546: 1 -0.433,0; 2 0.433,0
0603-RES = smd 0.7 x 1: 1 -0.65,0; 2 0.65,0
CAY16 = smd 0.5 x 0.65: 1 -1.2,-0.675; 2 -0.4,-0.675; 3 0.4,-0.675; 4 1.2,-0.675; 5 1.2,0.675; 6 0.4,0.675; 7 -0.4,0.675; 8 -1.2,0.675
MFS401N-2-Z = drill 0.8: 1 -5,1.25; 2 -3,1.25; 3 -1,1.25; 4 1,1.25; 5 3,1.25; 6 5,1.25; 7 -5,-1.25; 8 -3,-1.25; 9 -1,-1.25; 10 1,-1.25; 11 3,-1.25; 12 5,-1.25
EVQP2 = smd 1.676 x 0.813: P$1 -2.54,-0.87; P$2 -2.54,0.908; P$3 2.54,-0.87; P$4 2.54,0.908
TE_SSA12/SPDT = drill 1.092 pad 1.93: 1 -2.489,0; 2 2.489,0; IN 0,0
QFN32 = smd 0.6 x 0.3: 1 -2.3,1.75; 2 -2.3,1.25; 3 -2.3,0.75; 4 -2.3,0.25; 5 -2.3,-0.25; 6 -2.3,-0.75; 7 -2.3,-1.25; 8 -2.3,-1.75; 17 2.3,-1.75; 18 2.3,-1.25; 19 2.3,-0.75; 20 2.3,-0.25; 21 2.3,0.25; 22 2.3,0.75; 23 2.3,1.25; 24 2.3,1.75 | smd 0.3 x 0.6: 9 -1.75,-2.3; 10 -1.25,-2.3; 11 -0.75,-2.3; 12 -0.25,-2.3; 13 0.25,-2.3; 14 0.75,-2.3; 15 1.25,-2.3; 16 1.75,-2.3; 25 1.75,2.3; 26 1.25,2.3; 27 0.75,2.3; 28 0.25,2.3; 29 -0.25,2.3; 30 -0.75,2.3; 31 -1.25,2.3; 32 -1.75,2.3 | smd 3.2 x 3.2: EXP 0,0
MLF32 = smd 0.7 x 0.3: 1 -2.35,1.75; 2 -2.35,1.25; 3 -2.35,0.75; 4 -2.35,0.25; 5 -2.35,-0.25; 6 -2.35,-0.75; 7 -2.35,-1.25; 8 -2.35,-1.75; 17 2.35,-1.75; 18 2.35,-1.25; 19 2.35,-0.75; 20 2.35,-0.25; 21 2.35,0.25; 22 2.35,0.75; 23 2.35,1.25; 24 2.35,1.75 | smd 0.3 x 0.7: 9 -1.75,-2.35; 10 -1.25,-2.35; 11 -0.75,-2.35; 12 -0.25,-2.35; 13 0.25,-2.35; 14 0.75,-2.35; 15 1.25,-2.35; 16 1.75,-2.35; 25 1.75,2.35; 26 1.25,2.35; 27 0.75,2.35; 28 0.25,2.35; 29 -0.25,2.35; 30 -0.75,2.35; 31 -1.25,2.35; 32 -1.75,2.35 | smd 3.1 x 3.1: PAD 0,0
TSSOP-14/5MM = smd 1.5 x 0.35: 1 -2.95,1.95; 2 -2.95,1.3; 3 -2.95,0.65; 4 -2.95,0; 5 -2.95,-0.65; 6 -2.95,-1.3; 7 -2.95,-1.95; 8 2.95,-1.95; 9 2.95,-1.3; 10 2.95,-0.65; 11 2.95,0; 12 2.95,0.65; 13 2.95,1.3; 14 2.95,1.95
VSSOP-8 = smd 1.2 x 0.3: 1 -1.65,0.75; 2 -1.65,0.25; 3 -1.65,-0.25; 4 -1.65,-0.75; 5 1.65,-0.75; 6 1.65,-0.25; 7 1.65,0.25; 8 1.65,0.75
VFSOP-8 = smd 0.3 x 0.8: 1 -0.75,-1.55; 2 -0.25,-1.55; 3 0.25,-1.55; 4 0.75,-1.55; 5 0.75,1.55; 6 0.25,1.55; 7 -0.25,1.55; 8 -0.75,1.55
RLT0007A = smd 0.6 x 0.25: 1 -0.9,0.75; 2 -0.9,0.25; 3 -0.9,-0.25; 4 -0.9,-0.75 | smd 1.5 x 0.3: 5 0.45,-0.6; 6 0.45,0; 7 0.45,0.6
ABM3 = smd 1.9 x 2.4: P$1 -2.05,0; P$2 2.05,0
RESONATOR = smd 0.7 x 2: 1 -1,0; 2 0,0; 3 1,0

### Placement (x,y rotation side)
5V-VIN  46.99,13.72 270 top
C1  15.88,36.2 180 top
C2  22.23,36.2 0 top
C3  25.53,37.72 0 top
C4  44.7,34.8 270 top
C5  48.01,45.47 90 top
C6  24.38,60.45 180 top
C7  58.67,38.1 180 top
C8  54.1,37.85 180 top
C9  24.89,44.07 0 top
C10  32.51,45.47 90 top
C11  42.42,25.91 0 top
C12  46.48,23.62 180 top
C13  39.88,16.13 180 top
C14  13.84,44.45 180 top
C15  17.14,15.24 0 top
C16  19.68,14.61 270 top
D1  6.99,46.36 0 top
D2  34.92,5.4 90 top
D3  44.7,6.35 180 top
F1  15.88,24.77 0 top
J1  33.02,33.02 90 top
J2  41.27,0 0 top
J3  17.02,52.58 180 top
J4  63.64,34.24 270 top
J5  18.29,47.5 90 top
J-ARD-AD  55.88,8.89 0 top
J-ARD-I2C  18.8,57.15 0 top
J-ARD-IOH  31.5,57.15 180 top
J-ARD-IOL  53.34,57.15 180 top
J-ARD-POWER  38.1,8.89 0 top
L  35.31,29.21 90 top
L1  18.1,19.69 0 top
LOGO1  19.05,60.96 0 top
ON  39.88,29.21 90 top
R1  15.24,40.13 180 top
R2  15.24,41.4 180 top
R3  39.88,32 0 top
R4  35.31,32 0 top
R5  30.73,32 180 top
R6  26.16,32 180 top
R7  56.39,40.64 180 top
R8  56.39,43.18 180 top
R9  32.51,48.51 270 top
R10  18.92,36.2 0 top
R11  44.2,48.26 180 top
R12  17.78,8.89 0 top
RESET-PROG-EN  35.56,18.54 90 top
RESET-SIGN-EN  35.56,22.61 90 top
RN1  46.48,19.81 90 top
RX  26.16,29.21 90 top
S1  26.67,3.17 180 top
S2  30.99,20.83 270 top
S3  5.08,18.41 0 top
TX  30.73,29.21 90 top
U1  20.32,41.27 90 top
U2  45.85,39.88 270 top
U3  56.39,33.53 0 top
U4  26.92,48.51 180 top
U5  40.89,19.3 180 top
U6  40.89,22.86 270 top
VR1  17.14,12.06 90 top
Y1  19.05,33.66 0 top
Y2  44.2,44.96 0 top

### Tracks (layer width: path | path; a pad name or v marks a point on that pad's centre or on a via)
+3V3  (via drill 0.61)
  Top 0.254: VR1.3 17.39,10.54 17.89,10.04 | 17.89,10.04 18.41,9.52 18.41,8.9 R12.2 | VR1.4 17.89,10.04 | 19.07,8.25 19.05,8.25
  Top 0.508: 24.51,15.88 25.78,14.61 v25.78,10.93 25.78,8.89 25.15,8.25 19.07,8.25 R12.2 | 19.05,8.25 18.73,7.94 16.65,7.94 15.91,8.67 15.91,10.2 12.39,13.72 8.51,13.72 5.33,16.89 3.18,16.89 2.54,17.53 2.54,18.36 S3.1
  Bottom 0.508: v25.78,10.93 32.25,10.93 J-ARD-POWER.2
  pour Top: 19.05,19.05 19.05,15.24 24.89,15.24 24.89,22.86 21.59,22.86 20.32,21.59 20.32,16.51 19.68,16.51 19.68,19.05
+5V  (via drill 0.61)
  Top 0.254: VR1.1 16.01,11.16 15.75,11.43 15.75,12.45
  Top 0.508: S3.2 9.53,18.41 | D1.CATHODE 8,46.36 | 8,46.36 8.38,45.97 8.38,22.61 9.4,21.59 | 59.34,37.83 C7.1 | U4.14 23.37,46.56 | 23.37,46.56 22.52,46.56 21.21,47.88 21.21,49.66 J3.2 18.29,50.04 16,50.04 12.32,46.36 8,46.36 | C9.1 24.24,45.29 | 24.24,45.29 24.24,45.69 23.37,46.56 | 34.92,6.35 34.8,6.35 34.42,6.73 31.11,6.73 29.21,8.64 29.21,12.19 v29.72,12.7 | 24.24,45.29 25.22,45.29 v25.4,45.34 | v25.91,35.56 25.91,33.78 | J4.2 64.82,36.78 63.5,38.1 C7.1 | C7.1 59.31,38.09 v59.31,36.83 59.34,36.8 U3.14 | D3.CATHODE 43.69,6.35 v43.18,6.86
  Top 0.61: J-ARD-POWER.3 35.56,7.62 35.56,6.98 34.92,6.35 D2.CATHODE
  Bottom 0.508: v29.72,12.7 15.75,12.7 v15.24,13.21 | v25.4,45.34 25.4,40.64 25.91,40.13 v25.91,35.56 | v41.91,31.24 43.18,31.24 43.43,30.99 57.66,30.99 58.93,32.26 58.93,36.45 v59.31,36.83 | J-ARD-POWER.3 36.83,8.64 38.61,6.86 v43.18,6.86
  pour Top: 16.51,12.06 13.84,12.06 12.19,13.72 8.89,13.59 8.89,22.23 11.43,22.23 16.51,17.14
  pour Top: 24.89,30.23 42.93,30.23 42.93,32.77 39.12,36.58 24.89,36.58
AD0
  Top 0.254: J-ARD-AD.1 49.28,9.14 49.28,34.04 47.24,36.07 47.24,36.83 47.1,36.98 U2.23
AD1
  Top 0.254: J-ARD-AD.2 52.07,9.91 49.78,12.19 49.78,34.29 47.75,36.32 47.75,36.96 47.6,37.11 U2.24
AD2
  Top 0.254: J-ARD-AD.3 54.61,9.91 50.29,14.22 50.29,34.54 48.2,36.64 U2.25
AD3
  Top 0.254: U2.26 48.62,38.63 48.89,38.35 48.89,36.7 50.8,34.8 50.8,16.26 57.15,9.91 J-ARD-AD.4
AD4  (via drill 0.61)
  Top 0.254: J-ARD-AD.5 59.69,9.91 51.31,18.29 51.31,35.05 49.91,36.45 v49.91,38.23 49.01,39.13 U2.27 | J-ARD-I2C.2 20.07,57.66 21.46,59.05 41.02,59.05 42.04,58.04 42.04,55.5 v41.66,55.12 | v52.07,42.16 52.07,42.93 51.05,43.94 51.05,48.51 v51.43,48.9
  Bottom 0.254: v41.66,55.12 41.66,53.85 42.29,53.21 47.12,53.21 v51.43,48.9 | v49.91,38.23 50.42,38.23 51.31,39.12 51.31,41.4 v52.07,42.16
AD5  (via drill 0.61)
  Top 0.254: J-ARD-AD.6 61.47,8.89 60.96,9.4 60.96,10.16 51.82,19.3 51.82,35.31 50.8,36.32 50.8,38.86 v50.29,39.37 50.03,39.63 U2.28 | J-ARD-I2C.1 19.94,59.56 41.53,59.56 42.54,58.55 v42.54,54.1 | v50.93,42.67 50.93,42.8 50.55,43.18 50.55,49.78 v51.31,50.55
  Bottom 0.254: v42.54,54.1 47.75,54.1 v51.31,50.55 | v50.29,39.37 50.29,42.04 v50.93,42.67
ARD_USB_D+
  Top 0.254: S1.8 29.55,4.42 28.57,5.4 28.26,5.4 27.3,6.35 27.3,23.18 21.27,29.21 15.56,29.21 12.7,32.07 12.7,40.26 13.84,41.4 R2.2
ARD_USB_D+_TERM
  Top 0.254: U1.29 16.51,41.02 16.13,41.4 R2.1
ARD_USB_D-  (via drill 0.61)
  Top 0.254: v28.26,6.98 27.94,7.3 27.94,23.49 21.59,29.84 15.88,29.84 13.34,32.38 13.34,39.37 14.1,40.14 14.11,40.13 R1.2
  Bottom 0.254: S1.5 23.67,2.08 24.77,3.17 26.04,3.17 26.67,3.81 26.67,5.4 v28.26,6.98
ARD_USB_D-_TERM
  Top 0.254: U1.30 16.52,40.52 16.13,40.13 R1.1
ARD_USB_VBUS  (via drill 0.61)
  Top 0.406: v33.02,3.81 33.02,5.08 32,6.1 30.73,6.1 28.57,8.25 v28.57,24.77 | v23.5,24.77 F1.2
  Bottom 0.406: S1.2 29.67,2.05 30.99,3.36 32.58,3.36 v33.02,3.81 | v28.57,24.77 v23.5,24.77
AREF  (via drill 0.61)
  Top 0.254: J-ARD-IOH.8 22.61,55.88 23.88,54.61 23.88,51.82 24.38,51.31 30.48,51.31 31.75,50.04 33.78,50.04 35.56,48.26 35.56,41.15 42.42,34.29 42.42,34.04 44.32,32.13 45.08,32.13 45.6,32.64 U2.20 | C6.2 v22.61,60.45
  Bottom 0.254: v22.61,60.45 J-ARD-IOH.8
DTR_PROG  (via drill 0.61)
  Top 0.254: RN1.8 45.81,18.55 U5.1 42.54,18.16 42.16,17.78 v40.13,17.78 | v38.35,17.78 RESET-PROG-EN.1 RESET-PROG-EN.2 34.04,19.3 33.02,20.32 v33.02,35.05 | v33.02,38.61 30.73,38.61 27.82,41.52 U1.13
  Bottom 0.254: v38.35,17.78 v40.13,17.78 | v33.02,35.05 v33.02,38.61
EXT_USB_D+  (via drill 0.61)
  Top 0.254: J2.3 41.27,5.4 40,6.67 v36.51,6.67
  Bottom 0.254: v36.51,6.67 35.24,5.4 31.28,5.4 30.68,4.8 30.68,4.01 30.16,3.49 28.6,3.49 S1.9
EXT_USB_D-
  Top 0.254: J2.2 40.62,5.09 39.69,6.03 37.15,6.03 35.88,4.76 35.88,3.49 35.24,2.86 22.6,2.86 S1.6
EXT_USB_VBUS  (via drill 0.61)
  Top 0.254: J2.1 39.97,4.79 39.37,5.4 37.15,5.4 36.51,4.76 36.51,3.17 v34.92,1.59 34.29,0.95 28.64,0.95 S1.3
  Top 0.406: v34.92,3.81 D2.ANODE
  Bottom 0.406: v34.92,1.59 v34.92,3.81
GND  (via drill 0.61)
  Top 0.254: 19.57,40.25 19.82,39.99 | 19.57,40.25 U1.3 19.57,38.21 20.7,37.08 21.97,37.08 22.23,36.83 | U1.EXP 20.19,41.27 v19.3,40.39 19.43,40.39 19.57,40.25 | U2.5 45.6,41.02 45.97,40.64 | U2.3 46.6,41.26 45.97,40.64 | U2.21 46.1,39.22 | 46.1,39.22 46.1,40.52 45.97,40.64 | 46.1,39.22 45.35,39.22 v45.3,39.14 | U1.28 16.77,41.52 16.26,42.04 16.26,43.12 15.88,43.5 13.91,43.5 C14.2
  Top 0.305: 22.86,36.2 22.23,36.83
  other vias: 22.95,34.44 26.54,52.32 46.74,4.44 19.05,34.42 11.94,52.83 18.41,60.07 19.05,32.89 19.68,11.43 21.84,9.78 22.73,13.97 23.88,11.3 26.42,7.24 9.91,48.77 8.89,54.1 7.11,50.04 4.06,46.23 2.29,48.77 7.75,20.57 23.5,30.48 14.86,34.04 10.79,44.7 12.07,41.91 11.3,37.08 11.56,32.77 20.7,28.19 14.61,28.45 20.96,25.91 14.35,21.84 47.62,60.07 39.24,21.08 44.67,33.05 45.3,40.54 28.57,27.18 37.21,27.18 47.88,27.18 27.3,37.59 47.71,33.3 44.67,29.74 55.46,39.27 61.43,41.94 63.97,46.76 62.45,22.89 57.37,26.95 56.86,47.78 54.06,44.73 53.56,49.81 42.54,21.21 26.54,45.97 31.37,40.13 30.86,43.18 33.4,41.91 28.07,50.29 57.87,19.58 47.71,16.54 33.49,16.28 32.89,12.45
  pour Bottom (rank 2): -6.35,71.75 71.76,71.75 71.5,-6.35 -6.98,-6.35
  pour Top (rank 2): -5.08,73.02 71.12,73.02 71.12,-7.62 -5.08,-7.62
  pour Top: 17.46,12.7 17.46,15.88 18.41,15.88 18.41,13.97 24.89,13.97 24.89,8.89 19.05,8.89 19.05,11.43
IO0  (via drill 0.61)
  Top 0.254: U2.30 49.52,40.63 49.66,40.77 50.93,40.77 51.05,40.64 R7.2 55.74,41.54 v55.37,41.91 | J-ARD-IOL.1 59.94,54.86 59.94,52.58 57.91,50.55 v57.91,41.91
  Bottom 0.254: v55.37,41.91 v57.91,41.91
IO1
  Top 0.254: U2.31 49.26,41.13 49.4,41.27 53.21,41.27 55.12,43.18 R8.2 55.74,50.4 58.42,53.09 58.42,55.88 J-ARD-IOL.2
IO2
  Top 0.254: U2.32 48.99,41.63 50.04,42.67 50.04,50.55 52.07,52.58 55.12,52.58 56.13,53.59 56.13,56.13 J-ARD-IOL.3
IO3
  Top 0.254: U2.1 48.07,42.23 49.53,43.69 49.53,50.8 51.82,53.09 52.58,53.09 53.34,53.85 53.34,55.88 J-ARD-IOL.4
IO4
  Top 0.254: U2.2 47.1,42.78 47.24,42.93 48.01,42.93 49.02,43.94 49.02,51.05 51.05,53.09 51.05,56.13 J-ARD-IOL.5
IO5
  Top 0.254: U2.9 41.94,41.63 40.13,43.43 40.13,48.77 43.18,51.82 47.24,51.82 48.26,52.83 48.26,55.88 J-ARD-IOL.6
IO6
  Top 0.254: J-ARD-IOL.7 46.99,56.64 45.72,55.37 45.72,54.1 43.94,52.32 42.93,52.32 39.62,49.02 39.62,43.18 41.68,41.13 U2.10
IO7
  Top 0.254: U2.11 41.41,40.63 39.12,42.93 39.12,49.28 43.43,53.59 43.43,56.13 J-ARD-IOL.8
IO8
  Top 0.254: U2.12 41.15,40.13 38.61,42.67 38.61,49.53 39.37,50.29 39.37,56.13 J-ARD-IOH.1
IO9
  Top 0.254: U2.13 40.89,39.63 38.1,42.42 38.1,49.78 38.86,50.55 38.86,56.13 J-ARD-IOH.2
M8RXD  (via drill 0.61)
  Top 0.254: U1.9 23.21,39.52 23.62,39.12 27.56,39.12 28.96,37.72 35.18,37.72 v35.69,38.23 | v57.78,34.04 57.4,34.42 57.4,36.58 56.9,37.08 56.9,40.5 R7.1
  Bottom 0.254: v35.69,38.23 35.69,37.46 38.48,34.67 38.48,33.27 39.5,32.26 43.56,32.26 44.2,31.62 57.28,31.62 58.17,32.51 58.17,33.66 v57.78,34.04
M8TXD  (via drill 0.61)
  Top 0.254: U1.8 22.49,38.98 22.86,38.61 27.43,38.61 28.83,37.21 36.32,37.21 v36.7,37.59 | v57.28,32.89 57.28,33.15 56.9,33.53 56.9,36.32 56.39,36.83 56.39,42.16 57.04,42.81 R8.1
  Bottom 0.254: v36.7,37.59 38.99,35.31 38.99,33.4 39.62,32.77 43.69,32.77 44.32,32.13 56.51,32.13 v57.28,32.89
MISO  (via drill 0.61)
  Top 0.254: J-ARD-IOH.5 31.5,55.88 31.5,51.82 32.26,51.05 34.29,51.05 36.58,48.77 36.58,41.66 41.91,36.32 v42.54,36.32 42.54,37.72 42.95,38.13 U2.16 | U3.2 54.64,34.83 v55.24,35.43
  Bottom 0.254: v55.24,35.43 55.12,35.31 44.45,35.31 43.94,35.81 43.05,35.81 v42.54,36.32
MISO_PROG
  Top 0.254: U4.4 28.96,48.51 27.43,46.99 27.43,43.69 26.92,43.18 23.88,43.18 22.86,44.2 22.35,44.2 22.07,43.91 U1.17
MISO_PROG_SHIFTED
  Top 0.254: U4.11 22.86,48.51 22.35,49.02 22.35,50.04 21.21,51.18 21.21,52.2 J3.1
MISO_SHIFTED
  Top 0.254: U3.13 60.42,34.83 J4.1
MOD_5V
  Top 0.508: J1.2 6.35,46.15 D1.ANODE
MOD_IN  (via drill 0.61)
  Top 0.254: RN1.7 45.07,19.41 44.71,19.05 U5.2 41.65,19.05 v41.27,18.67 | v37.34,18.67 37.34,21.34 36.83,21.84 RESET-SIGN-EN.1 RESET-SIGN-EN.2 35.31,23.62 v33.91,23.62 | v9.4,29.21 9.91,29.21 12.19,26.92 v12.19,24.13 | v19.56,23.88 24.38,23.88 v24.64,23.62
  Bottom 0.254: J1.10 8.13,30.48 v9.4,29.21 | v41.27,18.67 v37.34,18.67 | v12.19,24.13 19.3,24.13 v19.56,23.88 | v24.64,23.62 v33.91,23.62
MOD_USB_D+
  Top 0.254: S1.7 31.67,4.36 30.61,3.3 21.08,3.3 arc-76 19.81,4.57 arc86 16.51,7.37 arc-93 15.38,8.45 15.38,9.97 13.16,12.19 7.87,12.19 4.83,15.24 2.79,15.24 1.27,16.76 1.27,26.16 3.05,27.94 J1.11
MOD_USB_D-
  Top 0.254: S1.4 25.67,1.67 25.18,1.17 arc-45 24.18,0.76 21.46,0.76 arc-90 19.3,2.79 19.3,3.63 arc90 15.95,6.98 arc-90 14.93,8.13 14.93,9.83 13.08,11.68 7.62,11.68 4.57,14.73 2.54,14.73 0.76,16.51 0.76,26.92 3.05,29.21 5.08,29.21 J1.12
MOD_USB_VBUS
  Bottom 0.508: S1.1 31.67,1.82 30.73,0.89 20.58,0.89 arc-90 19.56,1.91 19.56,3.81 arc90 16,7.37 arc-90 15.11,8.25 15.11,9.91 13.34,11.68 7.62,11.68 4.57,14.73 2.79,14.73 1.02,16.51 1.02,22.61 J1.13
MOSI  (via drill 0.61)
  Top 0.254: J-ARD-IOH.4 34.04,55.88 34.04,52.07 37.08,49.02 37.08,41.91 40.89,38.1 v41.78,38.1 42.31,38.63 U2.15 | U3.3 55.23,34.18 v55.24,34.16
  Bottom 0.254: v55.24,34.16 54.74,34.16 54.1,34.8 44.2,34.8 43.81,35.18 42.29,35.18 41.66,35.81 41.66,37.97 v41.78,38.1
MOSI_PROG
  Top 0.254: U4.3 29.07,47.86 27.94,46.74 27.94,43.43 27.18,42.67 23.62,42.67 23.27,43.02 U1.16
MOSI_PROG_SHIFTED  (via drill 0.61)
  Top 0.254: U4.12 25,47.86 v25.91,48.77
  Bottom 0.254: v25.91,48.77 25.65,48.77 24.38,50.04 18.29,50.04 J3.4
MOSI_SHIFTED
  Top 0.254: U3.12 60.59,34.18 61.72,35.31 63.84,35.31 J4.4
N$1
  Top 0.254: L.A 36.36,31.6 R4.2
N$2  (via drill 0.61)
  Top 0.254: v21.59,45.21 21.59,44.45 21.57,44.43 U1.18
  Bottom 0.254: J5.1 20.57,46.23 v21.59,45.21
N$3
  Top 0.254: ON.A 40.93,31.6 R3.2
N$4
  Top 0.254: U1.19 21.07,44.46 20.7,44.83 20.7,47.62 J5.3
N$5
  Top 0.254: U1.20 20.57,44.2 19.81,44.96 18.29,44.96 J5.2
N$6
  Top 0.254: U1.21 20.07,43.94 19.56,44.45 18.03,44.45 17.53,44.96 16.76,44.96 15.75,45.97 15.75,47.5 J5.4
N$7
  Top 0.254: U6.6 46.22,22.61 | 46.22,22.61 47.16,21.68 RN1.4 | C12.2 45.83,23 46.22,22.61
N$9
  Top 0.508: D3.ANODE 45.72,6.35 46.99,7.62 5V-VIN.2
N$10
  Top 0.254: U5.7 38.35,19.05 38.1,19.3 38.1,22.86 38.35,23.11 U6.2
N$13
  Top 0.254: U5.6 40.13,19.55 40.39,19.81 40.39,20.32 | 40.39,20.32 40.39,21.08 41.4,22.1 42.43,22.1 U6.5 | U5.5 40.12,20.05 40.39,20.32
N$35
  Top 0.254: RX.A 27.21,31.6 R6.1
N$36
  Top 0.254: TX.A 31.78,31.6 R5.1
POWER_GOOD
  Top 0.254: VR1.2 16.89,10.41 17.14,10.16 17.14,8.9 R12.1
RESET  (via drill 0.61)
  Top 0.254: U3.5 52.47,32.88 | 52.47,32.88 52.32,33.02 52.32,35.56 51.31,36.58 51.31,39.62 50.67,40.26 49.91,40.26 49.78,40.13 U2.29 | J-ARD-POWER.1 31.75,10.16 32,10.41 32,14.22 | 32,14.22 32,14.73 | 32,14.73 32,18.18 S2.P$4 | 31.75,18.27 S2.P$4 | S2.P$4 S2.P$2 | U5.3 44.45,19.55 45.1,20.21 | RN1.6 45.1,20.21 | 45.1,20.21 45.07,20.21 v44.45,20.83 | v52.83,20.83 52.32,21.34 52.32,32.74 52.47,32.88 | 32,14.73 32.26,14.48 | 32.26,14.48 32,14.22 | 32.26,14.48 42.16,14.48 v44.45,16.76
  Bottom 0.254: v52.83,20.83 v44.45,20.83 v44.45,16.76
RESET_PROG  (via drill 0.61)
  Top 0.254: U1.24 17.64,43.58 v17.27,43.94 | v25.65,46.99 27.83,49.16 U4.5 R9.1
  Bottom 0.254: v17.27,43.94 22.61,43.94 v25.65,46.99
RESET_PROG_SHIFTED
  Top 0.254: U4.10 23.23,49.16 22.86,49.53 22.86,50.29 21.72,51.44 21.72,53.85 20.24,55.32 15.95,55.32 J3.5
RESET_SHIFTED
  Top 0.254: U3.10 61.19,32.88 J4.5
RXLED  (via drill 0.61)
  Top 0.254: RX.C 25.11,29.24 24.77,29.59 24.77,35.69 v24.64,35.81 | U1.10 24.24,40.02 v24.64,40.01
  Bottom 0.254: v24.64,35.81 v24.64,40.01
SCK  (via drill 0.61)
  Top 0.254: J-ARD-IOH.6 27.69,56.39 28.96,55.12 28.96,53.59 32,50.55 34.04,50.55 36.07,48.51 36.07,41.4 43.18,34.29 v43.43,34.29 43.43,37.21 43.75,37.53 U2.17 | U3.4 54.61,33.53 v55.19,32.94 | v39.88,33.78 35.31,33.78 34.66,33.13 R4.1
  Bottom 0.254: v55.19,32.94 53.85,34.29 v43.43,34.29 40.39,34.29 v39.88,33.78
SCK_PROG
  Top 0.254: U4.2 29.18,47.21 28.45,46.48 28.45,43.18 27.43,42.16 23.37,42.16 23.01,42.52 U1.15
SCK_PROG_SHIFTED
  Top 0.254: U4.13 22.64,47.21 21.84,48.01 21.84,49.78 20.7,50.93 20.7,51.94 20.07,52.58 18.29,52.58 J3.3
SCK_SHIFTED
  Top 0.254: U3.11 61.66,33.53 J4.3
SS
  Top 0.254: U2.14 40.63,39.13 37.59,42.16 37.59,52.07 36.58,53.09 36.58,55.88 J-ARD-IOH.3
TXLED  (via drill 0.61)
  Top 0.254: TX.C 29.68,29.24 29.34,29.59 29.34,34.92 v29.21,35.05 | v29.21,38.61 29.21,39.37 27.69,40.89 24.13,40.89 23.76,40.52 U1.11
  Bottom 0.254: v29.21,35.05 v29.21,38.61
USBVCC  (via drill 0.61)
  Top 0.254: v14.48,39.12 16,39.12 16.91,40.02 U1.31
  Top 0.508: F1.1 13.93,26.21 9.4,30.73 9.4,38.99 v9.35,39.12
  Bottom 0.254: v9.35,39.12 v14.48,39.12
VCC  (via drill 0.61)
  Top 0.254: U1.32 17.43,39.52 17.02,39.12 v17.02,38.61 | 20.07,38.61 U1.4 20.07,38.35 20.45,37.97 v20.96,37.97 | U2.6 45.1,42.81 45.72,43.43 46.48,43.43 46.1,43.05 U2.4 | U6.8 43.19,23.61 | 43.19,23.61 43.43,23.37 | 43.43,23.37 43.18,23.11 U6.7 40.39,23.11 39.89,22.61 U6.3 | 43.43,23.37 43.94,23.37 45.21,24.64 46.74,24.64 47.13,24.24 C12.1 48.01,22.75 48.01,20.32 47.9,20.21 47.86,20.21 | RN1.1 47.82,18.61 | 47.82,18.61 48.01,18.8 48.01,19.3 47.9,19.41 | RN1.2 47.9,19.41 | 47.9,19.41 47.9,19.45 48.01,19.56 48.01,20.07 47.86,20.21 | RN1.3 47.86,20.21 | C13.2 39.23,16.77 | 39.23,16.77 39.23,17.17 | 39.23,17.17 39.23,18.54 U5.8 | 47.82,18.61 47.82,18.47 48.01,18.29 48.01,18.03 47.75,17.78 43.18,17.78 42.37,16.97 39.43,16.97 39.23,17.17 | 39.23,16.77 39.42,16.97 | 47.89,44.7 C5.1 | U2.18 44.6,36.61 v44.7,36.5 | U3.8 57.32,31.58 56.39,32.51 56.39,35.81 55.63,36.58 53.69,36.58 53.44,36.83 | U4.8 26.24,50.46 v26.42,50.29 | U4.1 31.41,46.56 31.86,46.12 | C10.2 31.86,46.12 | v30.48,45.47 30.99,45.47 31.64,46.12 31.86,46.12 | C3.1 24.64,37.59 24.26,37.72 | C11.2 43.07,23.73 43.19,23.61
  Top 0.406: 46.48,43.43 47.24,43.43 48.01,44.2 C5.1
  Top 0.508: J1.4 7.62,36.83 7.62,22.23 5.08,19.69 S3.IN | U3.1 53.44,36.83 53.44,37.83 C8.2 52.45,37.85 | v46.74,44.7 47.89,44.7 | 39.12,36.58 25.4,36.58 24.26,37.72 21.21,37.72 v20.96,37.97 | 39.12,36.58 43.07,32.62 | 43.07,32.62 44.2,31.5 45.47,31.5 46.35,32.38 46.35,36.4 v46.41,36.45 | v52.2,37.08 52.2,37.59 52.45,37.85 | v44.7,36.5 C4.1 | C11.2 43.07,32.62 | 52.45,37.85 52.45,37.97 52.2,38.23 | 52.2,38.23 52.2,37.21 52.32,37.08 | 52.2,38.23 52.2,39.5 v52.32,39.62 | 39.12,36.58 34.92,40.77 34.92,45.34 | 34.92,45.34 34.15,46.12 C10.2 | 34.92,45.34 34.92,47.37 34.43,47.86 R9.2
  Bottom 0.254: v26.42,50.29 26.92,49.78 26.92,49.02 v30.48,45.47
  Bottom 0.508: J1.4 16.51,38.1 v17.02,38.61 20.32,38.61 v20.96,37.97 | v52.2,37.08 51.58,36.46 46.42,36.46 v46.41,36.45 46.35,36.5 v44.7,36.5 | v52.32,39.62 52.83,40.13 52.83,41.4 53.09,41.66 53.09,42.67 52.58,43.18 51.82,43.18 51.31,43.69 47.75,43.69 v46.74,44.7
VIN
  Top 0.508: J-ARD-POWER.6 44.45,13.21 45.72,14.48 5V-VIN.1
VR_IND_SW
  Top 0.254: VR1.6 17.14,17.46 16.92,17.69 L1.1
  pour Top: 15.88,19.05 17.14,17.78 17.78,17.78 17.78,22.86 15.88,22.86
VUCAP
  Top 0.254: U1.27 17.03,42.02 16.76,42.29 16.76,43.31 15.62,44.45 C14.1
XT1
  Top 0.254: U1.1 18.57,37.11 18.29,36.83 18.29,36.21 R10.1 C1.1
  Top 0.508: C1.1 16.76,33.89 Y1.P$1
XT2
  Top 0.254: U1.2 19.07,37.32 19.56,36.83 19.56,36.21 R10.2 C2.1
  Top 0.508: C2.1 21.34,33.89 Y1.P$2
XTAL1
  Top 0.254: U2.7 44.6,43.07 45.2,43.67 Y2.3 45.2,46.5 44.96,46.74 44.96,48.15 R11.1
XTAL2
  Top 0.254: U2.8 44.1,42.77 43.2,43.67 Y2.1 43.2,46.5 43.43,46.74 43.43,48.15 R11.2

### Text on the board
tPlace: Seinduino | Pat Pannuto | 2016-08-30 | Rev A | 13 | 12 | 11 | 10 | 9 | 8 | 7 | 6 | 5 | 4 | 3 | 2 | 1 | 0 | 3.3V | 5V
tNames: AREF | GND | # | # | # | # | # | # | DIGITAL | [#=PWM] | TX | RX | 1 | A5 | A4 | A3 | POWER | ANALOG IN | A2 | A1 | RESET | 3V3 | 5V | GND | VIN* | A0
bNames: MADE IN | designed by | MADE IN | ITALY | tinker it | ITALY | designed by | tinker it | ATMEGA328
tDocu: Reference Designs ARE PROVIDED "AS IS" AND "WITH ALL FAULTS. Arduino DISCLAIMS ALL OTHER WARRANTIES, EXPRESS OR IMPLIED, | REGARDING PRODUCTS, INCLUDING BUT NOT LIMITED TO, ANY IMPLIED WARRANTIES OF MERCHANTABILITY OR FITNESS FOR A PARTICULAR PURPOSE | Arduino may make changes to specifications and product descriptions at any time, without notice. The Customer must not | rely on the absence or characteristics of any features or instructions marked "reserved" or "undefined." Arduino reserves | these for future definition and shall have no responsibility whatsoever for conflicts or incompatibilities arising from future changes to them. | The product information on the Web Site or Materials is subject to change without notice. Do not finalize a design with this information. | M.Banzi | D.Cuartielles | Note: Pad connects / to ground, but this / part from Arduino / neglects that, and / they do not provide / lbrs so cannot fix :( | T.Igoe | G.Martino | D.Mellis | MADE IN | ITALY | TM | Arduino | SMD | UNO | Edition | www.arduino.cc
214bmp: D:/SmartProjects/Snc/a4_bn_logo2.bmp